# EAGLE design LEDmeterboard4mmRised (EAGLE 7.2.0)
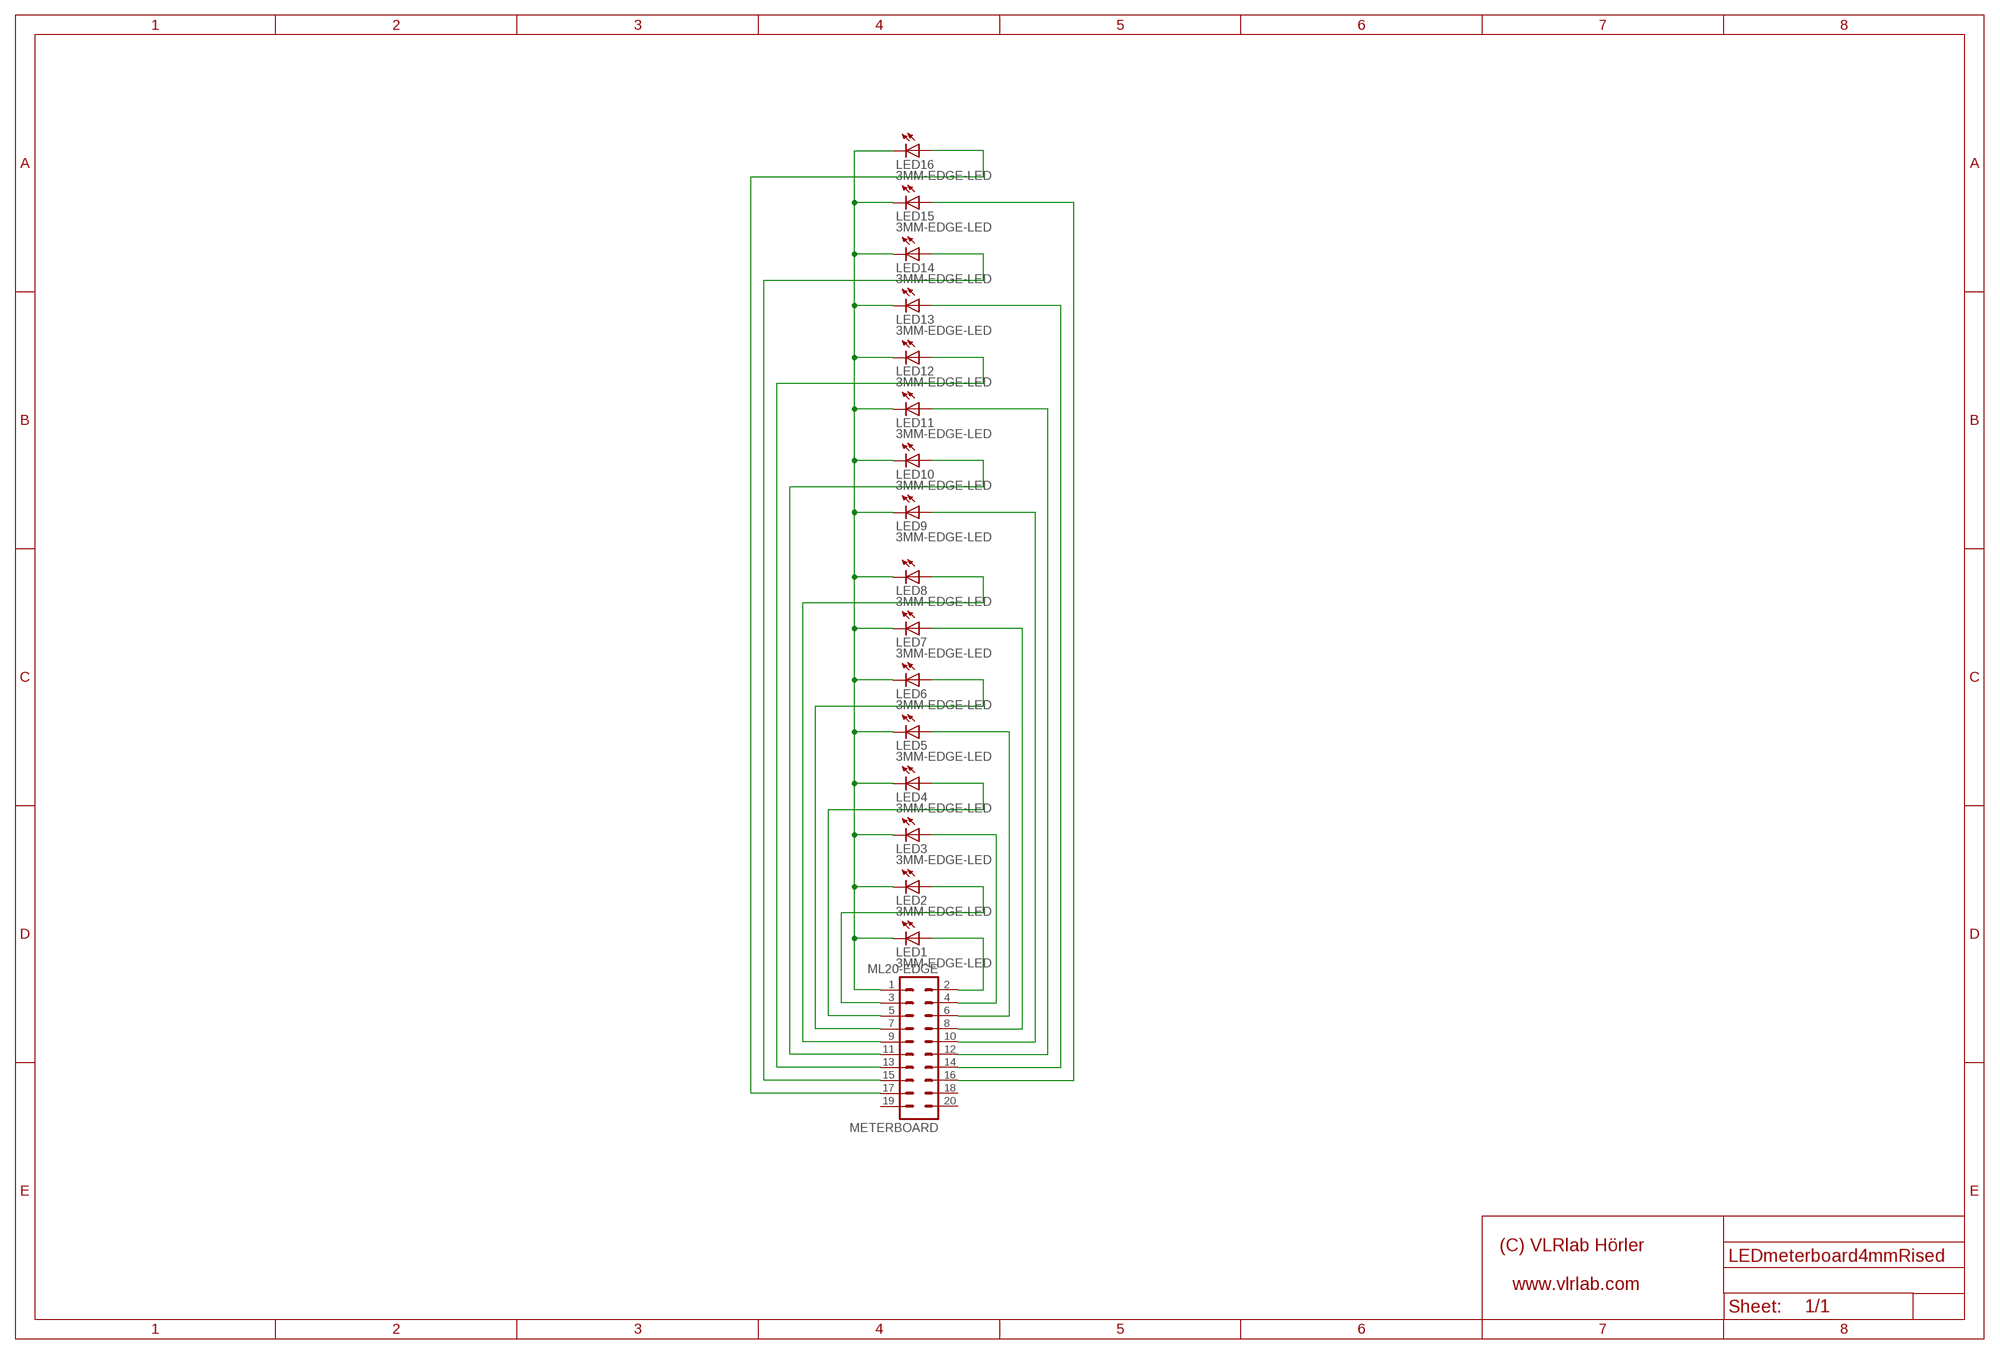
[diagram p0: schematic, sheet 1]

## Parts
LED1  3MM-EDGE-LED  [3MM-EDGE-LED]
LED2  3MM-EDGE-LED  [3MM-EDGE-LED]
LED3  3MM-EDGE-LED  [3MM-EDGE-LED]
LED4  3MM-EDGE-LED  [3MM-EDGE-LED]
LED5  3MM-EDGE-LED  [3MM-EDGE-LED]
LED6  3MM-EDGE-LED  [3MM-EDGE-LED]
LED7  3MM-EDGE-LED  [3MM-EDGE-LED]
LED8  3MM-EDGE-LED  [3MM-EDGE-LED]
LED9  3MM-EDGE-LED  [3MM-EDGE-LED]
LED10  3MM-EDGE-LED  [3MM-EDGE-LED]
LED11  3MM-EDGE-LED  [3MM-EDGE-LED]
LED12  3MM-EDGE-LED  [3MM-EDGE-LED]
LED13  3MM-EDGE-LED  [3MM-EDGE-LED]
LED14  3MM-EDGE-LED  [3MM-EDGE-LED]
LED15  3MM-EDGE-LED  [3MM-EDGE-LED]
LED16  3MM-EDGE-LED  [3MM-EDGE-LED]
METERBOARD  ML20-EDGE  [ML20EDGE]

## Nets
N$1: LED1.KATHODE(C) LED2.KATHODE(C) LED3.KATHODE(C) LED4.KATHODE(C) LED5.KATHODE(C) LED6.KATHODE(C) LED7.KATHODE(C) LED8.KATHODE(C) LED9.KATHODE(C) LED10.KATHODE(C) LED11.KATHODE(C) LED12.KATHODE(C) LED13.KATHODE(C) LED14.KATHODE(C) LED15.KATHODE(C) LED16.KATHODE(C) METERBOARD.1
N$2: LED1.ANODE(A) METERBOARD.2
N$3: LED2.ANODE(A) METERBOARD.3
N$4: LED3.ANODE(A) METERBOARD.4
N$5: LED4.ANODE(A) METERBOARD.5
N$6: LED5.ANODE(A) METERBOARD.6
N$7: LED6.ANODE(A) METERBOARD.7
N$8: LED7.ANODE(A) METERBOARD.8
N$9: LED8.ANODE(A) METERBOARD.9
N$10: LED9.ANODE(A) METERBOARD.10
N$11: LED10.ANODE(A) METERBOARD.11
N$12: LED11.ANODE(A) METERBOARD.12
N$13: LED12.ANODE(A) METERBOARD.13
N$14: LED13.ANODE(A) METERBOARD.14
N$15: LED14.ANODE(A) METERBOARD.15
N$16: LED15.ANODE(A) METERBOARD.16
N$17: LED16.ANODE(A) METERBOARD.17
Unconnected: METERBOARD.18 METERBOARD.19 METERBOARD.20

## Library data of the parts
LED1-LED16 = led:3MM-EDGE-LED
METERBOARD = con-ml_Ivan:ML20-EDGE

## Board
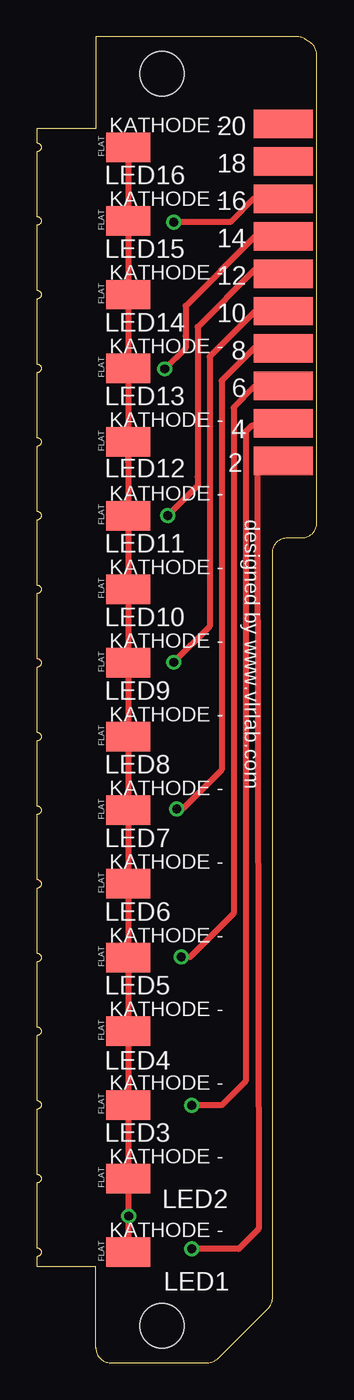
[diagram p1: board, top side]
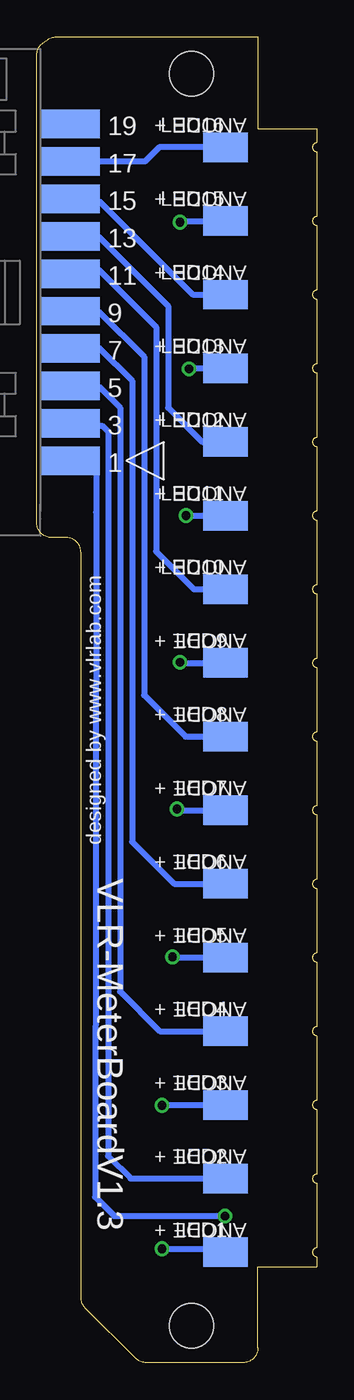
[diagram p2: board, bottom side, seen from below]

Size 19 x 90 mm. Coordinates in mm from the lower left corner, seen from the top.
Outline: 4,1 arc90 5,0 11.59,0 arc45 12.29,0.29 15.71,3.71 arc45 16,4.41 16,5 16,55 arc-90 17,56 18,56 arc90 19,57 19,88.78 arc55 18.57,89.6 18.26,89.82 arc35 17.69,90 5,90 4,90 4,84 4,83.75 0,83.75 0,82.8 arc-180 0,82.2 0,77.8 arc-180 0,77.2 0,72.8 arc-180 0,72.2 0,67.8 arc-180 0,67.2 0,62.8 arc-180 0,62.2 0,57.8 arc-180 0,57.2 0,52.8 arc-180 0,52.2 0,47.8 arc-180 0,47.2 0,42.8 arc-180 0,42.2 0,37.8 arc-180 0,37.2 0,32.8 arc-180 0,32.2 0,27.8 arc-180 0,27.2 0,22.8 arc-180 0,22.2 0,17.8 arc-180 0,17.2 0,12.8 arc-180 0,12.2 0,7.8 arc-180 0,7.2 0,6.5 4,6.5 4,1
Copper layers (1*16): Top 0.035mm / dielectric 1.5mm / Bottom 0.035mm
Design rules "default *": minimum track width 10mil, minimum drill 13mil, track to track 8mil, track to pad 8mil, pad to pad 8mil, via to via 8mil, smd to smd 8mil, copper to edge 10mil, drill to drill 10mil, minimum pad ring 10mil, minimum via ring 8mil, stop-mask expansion 4mil, vias tented up to drill 0mil, thermal gap 0mil
Holes 3 mm at 8.5,2.5 8.5,87.5

### Footprints (pad centres in the part's own frame; a part is rotated, then mirrored left to right if it is on the bottom)
3MM-EDGE-LED = smd 3 x 2 bottom: ANODE 2,0 | smd 3 x 2: KATHODE 2,0
ML20EDGE = smd 4 x 1.93: 1 0,-11.43; 3 0,-8.89; 5 0,-6.35; 7 0,-3.81; 9 0,-1.27; 11 0,1.27; 13 0,3.81; 15 0,6.35; 17 0,8.89; 19 0,11.43 | smd 4 x 1.93 bottom: 2 0,-11.43; 4 0,-8.89; 6 0,-6.35; 8 0,-3.81; 10 0,-1.27; 12 0,1.27; 14 0,3.81; 16 0,6.35; 18 0,8.89; 20 0,11.43

### Placement (x,y rotation side)
LED1  4.2,7.5 0 top
LED2  4.2,12.5 0 top
LED3  4.2,17.5 0 top
LED4  4.2,22.5 0 top
LED5  4.2,27.5 0 top
LED6  4.2,32.5 0 top
LED7  4.2,37.5 0 top
LED8  4.2,42.5 0 top
LED9  4.2,47.5 0 top
LED10  4.2,52.5 0 top
LED11  4.2,57.5 0 top
LED12  4.2,62.5 0 top
LED13  4.2,67.5 0 top
LED14  4.2,72.5 0 top
LED15  4.2,77.5 0 top
LED16  4.2,82.5 0 top
METERBOARD  16.73,72.65 0 bottom

### Tracks (layer width: path | path; a pad name or v marks a point on that pad's centre or on a via)
N$1  (via drill 0.6)
  Top 0.406: LED16.KATHODE LED15.KATHODE LED14.KATHODE LED13.KATHODE LED12.KATHODE | LED12.KATHODE 6.2,61.16 | 6.2,61.16 LED12.KATHODE | 6.2,61.16 LED11.KATHODE LED10.KATHODE LED9.KATHODE LED8.KATHODE LED7.KATHODE LED6.KATHODE LED5.KATHODE LED4.KATHODE LED3.KATHODE LED2.KATHODE LED1.KATHODE 6.23,7.5 v6.23,9.96
  Bottom 0.406: METERBOARD.1 16.68,61.16 14.97,61.16 14.97,57.71 15.05,11.25 13.75,9.96 v6.23,9.96 6.2,9.96
N$2  (via drill 0.6)
  Top 0.406: METERBOARD.2 14.97,61.22 14.97,58.73 15.05,9.08 13.7,7.72 v10.5,7.72
  Bottom 0.406: v10.5,7.72 6.42,7.72 LED1.ANODE
N$3
  Bottom 0.406: METERBOARD.3 16.57,63.6 14.57,63.6 14.16,63.2 14.16,14.02 12.64,12.5 LED2.ANODE
N$4  (via drill 0.6)
  Top 0.406: METERBOARD.4 16.57,63.6 14.57,63.6 14.16,63.2 14.16,19.1 12.53,17.48 v10.5,17.48
  Bottom 0.406: v10.5,17.48 10.48,17.5 LED3.ANODE
N$5
  Bottom 0.406: METERBOARD.5 16.68,66.24 14.77,66.24 13.35,64.82 13.35,25.2 10.65,22.5 LED4.ANODE 6.2,22.55
N$6  (via drill 0.6)
  Top 0.406: METERBOARD.6 16.68,66.24 14.77,66.24 13.35,64.82 13.35,30.48 10.4,27.54 v9.79,27.54
  Bottom 0.406: v9.79,27.54 9.76,27.5 LED5.ANODE
N$7
  Bottom 0.406: METERBOARD.7 16.69,68.89 14.77,68.89 12.53,66.65 12.53,35.36 9.68,32.5 LED6.ANODE
N$8  (via drill 0.6)
  Top 0.406: METERBOARD.8 16.69,68.89 14.77,68.89 12.53,66.65 12.53,40.23 9.89,37.59 v9.49,37.59
  Bottom 0.406: v9.49,37.59 9.39,37.5 LED7.ANODE
N$9
  Bottom 0.406: METERBOARD.9 16.68,71.32 14.77,71.32 11.72,68.28 11.72,45.31 8.91,42.5 LED8.ANODE
N$10  (via drill 0.6)
  Top 0.406: METERBOARD.10 16.68,71.32 14.77,71.32 11.72,68.28 11.72,49.99 v9.28,47.55
  Bottom 0.406: v9.28,47.55 9.23,47.5 LED9.ANODE
N$11
  Bottom 0.406: METERBOARD.11 16.48,74.17 14.77,74.17 10.91,70.31 10.91,55.07 8.34,52.5 LED10.ANODE
N$12  (via drill 0.6)
  Top 0.406: METERBOARD.12 16.48,74.17 14.77,74.17 10.91,70.31 10.91,60.15 10.91,59.54 v8.88,57.51
  Bottom 0.406: v8.88,57.51 v8.87,57.5 LED11.ANODE
N$13
  Bottom 0.406: METERBOARD.13 16.68,76.4 14.77,76.4 10.1,71.73 10.1,64.82 7.78,62.5 LED12.ANODE
N$14  (via drill 0.6)
  Top 0.406: METERBOARD.14 16.68,76.4 14.77,76.4 10.1,71.73 10.1,69.7 10.1,68.89 v8.67,67.46
  Bottom 0.406: v8.67,67.46 8.64,67.5 LED13.ANODE
N$15
  Bottom 0.406: METERBOARD.15 16.57,78.84 14.77,78.84 8.43,72.5 LED14.ANODE
N$16  (via drill 0.6)
  Top 0.406: METERBOARD.16 16.69,79.05 14.77,79.05 13.14,77.42 v9.28,77.42
  Bottom 0.406: v9.28,77.42 9.2,77.5 LED15.ANODE
N$17
  Bottom 0.406: LED16.ANODE 10.71,82.5 11.66,81.54 METERBOARD.17

### Text on the board
tNames: designed by www.vlrlab.com
bNames: LED16 | LED15 | LED14 | LED13 | LED12 | LED11 | LED10 | LED9 | LED8 | LED7 | designed by www.vlrlab.com | LED6 | VLR-MeterBoardV1.3 | LED5 | LED4 | LED3 | LED2 | LED1